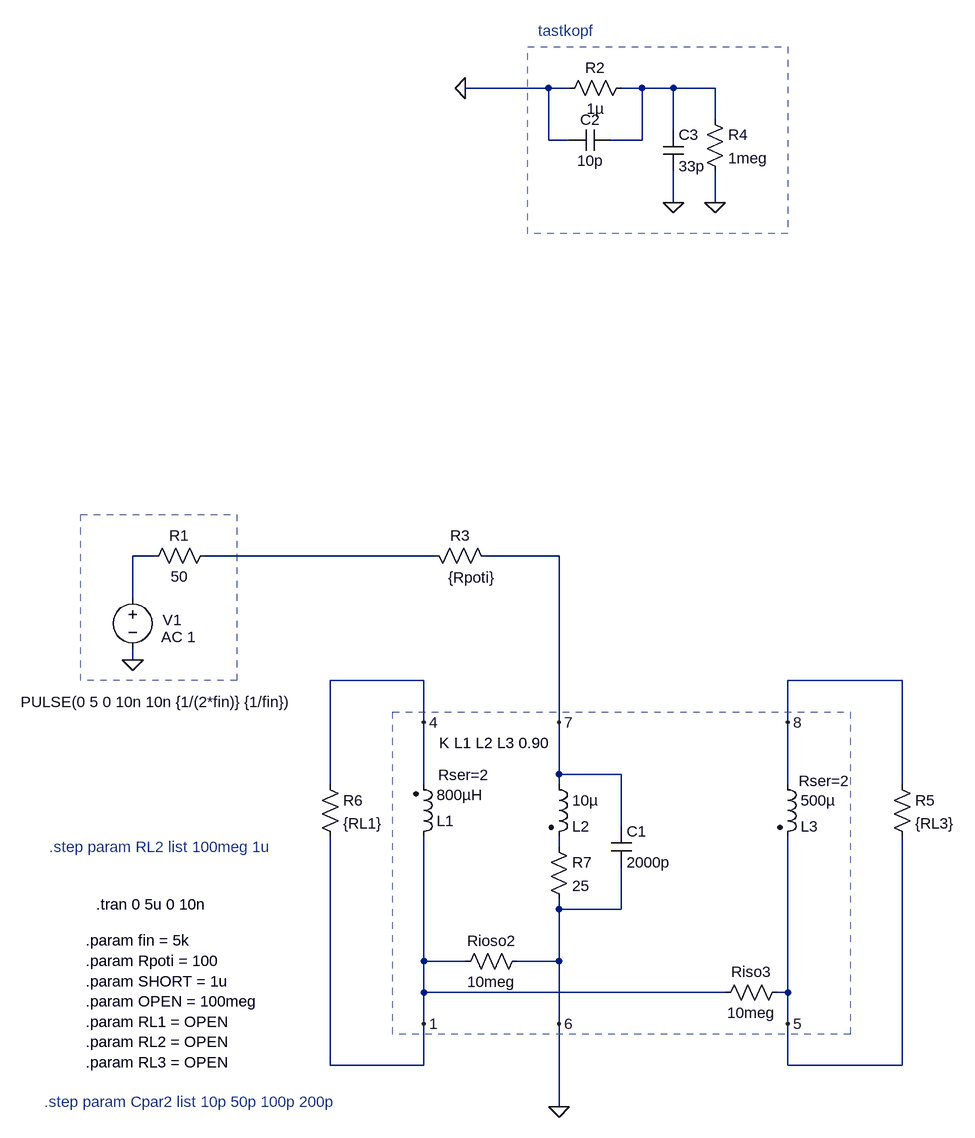
[diagram p0: schematic trafo_L2_bestimmen.asc]
trafo_L2_bestimmen.asc, the LTspice schematic file:
Version 4
SHEET 1 880 688
WIRE -96 -1120 -224 -1120
WIRE -64 -1120 -96 -1120
WIRE 48 -1120 16 -1120
WIRE 96 -1120 48 -1120
WIRE 160 -1120 96 -1120
WIRE 160 -1072 160 -1120
WIRE 96 -1056 96 -1120
WIRE -96 -1040 -96 -1120
WIRE -64 -1040 -96 -1040
WIRE 48 -1040 48 -1120
WIRE 48 -1040 0 -1040
WIRE 96 -944 96 -992
WIRE 160 -944 160 -992
WIRE -704 -400 -736 -400
WIRE -272 -400 -624 -400
WIRE -80 -400 -192 -400
WIRE -736 -336 -736 -400
WIRE -736 -240 -736 -256
WIRE -288 -208 -432 -208
WIRE 448 -208 272 -208
WIRE -288 -144 -288 -208
WIRE -80 -144 -80 -400
WIRE 272 -144 272 -208
WIRE -80 -64 -80 -144
WIRE 16 -64 -80 -64
WIRE -432 -48 -432 -208
WIRE -288 -48 -288 -144
WIRE -80 -48 -80 -64
WIRE 272 -48 272 -144
WIRE 448 -48 448 -208
WIRE 16 16 16 -64
WIRE -80 48 -80 32
WIRE -80 144 -80 128
WIRE 16 144 16 80
WIRE 16 144 -80 144
WIRE -288 224 -288 32
WIRE -224 224 -288 224
WIRE -80 224 -80 144
WIRE -80 224 -144 224
WIRE -288 272 -288 224
WIRE 176 272 -288 272
WIRE 272 272 272 32
WIRE 272 272 256 272
WIRE -288 320 -288 272
WIRE -80 320 -80 224
WIRE 272 320 272 272
WIRE -432 384 -432 32
WIRE -288 384 -288 320
WIRE -288 384 -432 384
WIRE 272 384 272 320
WIRE 448 384 448 32
WIRE 448 384 272 384
WIRE -80 448 -80 320
FLAG -736 -240 0
FLAG -288 -144 4
FLAG -288 320 1
FLAG -80 -144 7
FLAG 272 -144 8
FLAG 272 320 5
FLAG -80 320 6
FLAG -80 448 0
FLAG 160 -944 0
FLAG 96 -944 0
FLAG -224 -1120 0
SYMBOL ind2 -304 48 M180
WINDOW 39 38 111 Left 2
SYMATTR SpiceLine Rser=2
SYMATTR InstName L1
SYMATTR Value 800µH
SYMATTR Type ind
SYMBOL ind2 -96 -64 R0
WINDOW 0 36 80 Left 2
WINDOW 3 36 40 Left 2
WINDOW 39 -54 0 Left 2
SYMATTR InstName L2
SYMATTR Value 10µ
SYMATTR Type ind
SYMBOL ind2 256 -64 R0
WINDOW 0 36 80 Left 2
WINDOW 3 36 40 Left 2
WINDOW 39 33 10 Left 2
SYMATTR InstName L3
SYMATTR Value 500µ
SYMATTR SpiceLine Rser=2
SYMATTR Type ind
SYMBOL res 272 256 R90
WINDOW 0 0 56 VBottom 2
WINDOW 3 32 56 VTop 2
SYMATTR InstName Riso3
SYMATTR Value 10meg
SYMBOL res -128 208 R90
WINDOW 0 0 56 VBottom 2
WINDOW 3 32 56 VTop 2
SYMATTR InstName Rioso2
SYMATTR Value 10meg
SYMBOL res -288 -416 M90
WINDOW 0 0 56 VBottom 2
WINDOW 3 34 74 VTop 2
SYMATTR InstName R3
SYMATTR Value {Rpoti}
SYMBOL voltage -736 -352 R0
WINDOW 3 -172 177 Left 2
WINDOW 123 44 77 Left 2
WINDOW 39 0 0 Left 2
WINDOW 0 46 51 Left 2
SYMATTR Value PULSE(0 5 0 10n 10n {1/(2*fin)} {1/fin})
SYMATTR Value2 AC 1
SYMATTR InstName V1
SYMBOL res 32 -1136 R90
WINDOW 0 0 56 VBottom 2
WINDOW 3 32 56 VTop 2
SYMATTR InstName R2
SYMATTR Value 1µ
SYMBOL cap 0 -1056 R90
WINDOW 0 0 32 VBottom 2
WINDOW 3 32 32 VTop 2
SYMATTR InstName C2
SYMATTR Value 10p
SYMBOL cap 80 -1056 R0
SYMATTR InstName C3
SYMATTR Value 33p
SYMBOL res 144 -1088 R0
SYMATTR InstName R4
SYMATTR Value 1meg
SYMBOL res -608 -416 R90
WINDOW 0 0 56 VBottom 2
WINDOW 3 32 56 VTop 2
SYMATTR InstName R1
SYMATTR Value 50
SYMBOL res 432 -64 R0
SYMATTR InstName R5
SYMATTR Value {RL3}
SYMBOL res -448 -64 R0
SYMATTR InstName R6
SYMATTR Value {RL1}
SYMBOL res -96 32 R0
SYMATTR InstName R7
SYMATTR Value 25
SYMBOL cap 0 16 R0
SYMATTR InstName C1
SYMATTR Value 2000p
TEXT -264 -112 Left 2 !K L1 L2 L3 0.90
TEXT -792 136 Left 2 !.tran 0 5u 0 10n
TEXT -808 192 Left 2 !.param fin = 5k\n.param Rpoti = 100\n.param SHORT = 1u\n.param OPEN = 100meg\n.param RL1 = OPEN\n.param RL2 = OPEN\n.param RL3 = OPEN
TEXT -864 48 Left 2 ;.step param RL2 list 100meg 1u
TEXT -112 -1208 Left 2 ;tastkopf
TEXT -872 440 Left 2 ;.step param Cpar2 list 10p 50p 100p 200p
RECTANGLE Normal 368 336 -336 -160 2
RECTANGLE Normal 272 -896 -128 -1184 2
RECTANGLE Normal -576 -208 -816 -464 2

The netlist it stands for:
* trafo_L2_bestimmen.asc
L1 1 4 800µH Rser=2
L2 7 N004 10µ
L3 8 5 500µ Rser=2
Riso3 5 1 10meg
Rioso2 0 1 10meg
R3 N003 7 {Rpoti}
V1 N002 0 PULSE(0 5 0 10n 10n {1/(2*fin)} {1/fin}) AC 1
R2 N001 0 1µ
C2 N001 0 10p
C3 N001 0 33p
R4 N001 0 1meg
R1 N003 N002 50
R5 8 5 {RL3}
R6 4 1 {RL1}
R7 N004 0 25
C1 7 0 2000p
K L1 L2 L3 0.90
.tran 0 5u 0 10n
.param fin = 5k
.param Rpoti = 100
.param SHORT = 1u
.param OPEN = 100meg
.param RL1 = OPEN
.param RL2 = OPEN
.param RL3 = OPEN
* .step param RL2 list 100meg 1u
* tastkopf
* .step param Cpar2 list 10p 50p 100p 200p
.backanno
.end